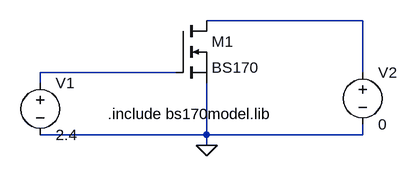
[diagram p0: schematic Draft1.asc]
Draft1.asc, the LTspice schematic file:
Version 4
SHEET 1 880 680
WIRE 480 80 240 80
WIRE 192 160 -16 160
WIRE 480 160 480 80
WIRE -16 176 -16 160
WIRE 240 256 240 176
WIRE 240 256 -16 256
WIRE 480 256 480 240
WIRE 480 256 240 256
WIRE 240 272 240 256
FLAG 240 272 0
SYMBOL nmos 192 80 R0
SYMATTR InstName M1
SYMATTR Value BS170
SYMBOL voltage -16 160 R0
WINDOW 123 0 0 Left 0
WINDOW 39 0 0 Left 0
SYMATTR InstName V1
SYMATTR Value 2.4
SYMBOL voltage 480 144 R0
WINDOW 123 0 0 Left 0
WINDOW 39 0 0 Left 0
SYMATTR InstName V2
SYMATTR Value 0
TEXT 88 224 Left 2 !.include bs170model.lib

The netlist it stands for:
* Draft1.asc
M1 N001 N002 0 0 BS170
V1 N002 0 2.4
V2 N001 0 0
.model NMOS NMOS
.model PMOS PMOS
.lib standard.mos
.include bs170model.lib
.backanno
.end